# Altium project dualring_rx_v0.1_sensor.PrjPcb
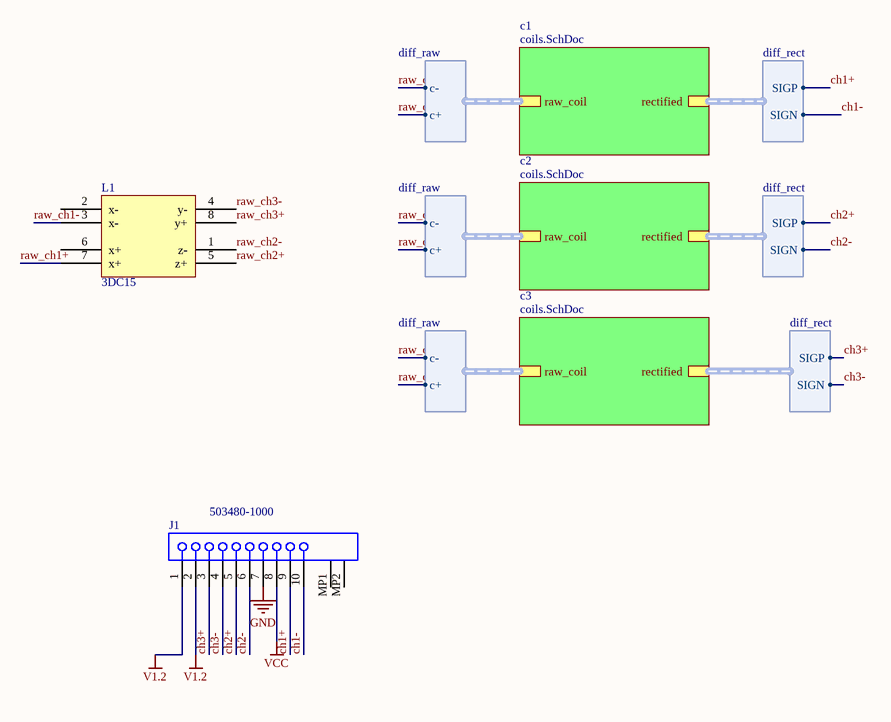
[diagram p0: coil_processing.SchDoc]
2 sheets, 44 parts. Net scope: hierarchical (ports join the sheet entries above them; power ports are global).
Sheets:
  coil_processing.SchDoc
    c1 = coils.SchDoc
    c2 = coils.SchDoc
    c3 = coils.SchDoc

## Sheet coil_processing.SchDoc
size A

### Parts
J1  503480-1000  [MOLX-503480-1000]
L1  3DC15  [3DC15]

### Sub-sheets
c1 = coils.SchDoc: raw_coil (harness diff_raw), rectified (harness diff_rect)
c2 = coils.SchDoc: raw_coil (harness diff_raw), rectified (harness diff_rect)
c3 = coils.SchDoc: raw_coil (harness diff_raw), rectified (harness diff_rect)

### Harnesses
diff_raw: c-, c+
diff_rect: SIGN, SIGP

### Nets
GND: J1.7
V1.2: J1.1 J1.2
VCC: J1.8
ch1+: J1.9 ; sheet c1/rectified.SIGP
ch1-: J1.10 ; sheet c1/rectified.SIGN
ch2+: J1.5 ; sheet c2/rectified.SIGP
ch2-: J1.6 ; sheet c2/rectified.SIGN
ch3+: J1.3 ; sheet c3/rectified.SIGP
ch3-: J1.4 ; sheet c3/rectified.SIGN
raw_ch1+: L1.7(x+) ; sheet c1/raw_coil.c+
raw_ch1-: L1.3(x-) ; sheet c1/raw_coil.c-
raw_ch2+: L1.5(z+) ; sheet c2/raw_coil.c+
raw_ch2-: L1.1(z-) ; sheet c2/raw_coil.c-
raw_ch3+: L1.8(y+) ; sheet c3/raw_coil.c+
raw_ch3-: L1.4(y-) ; sheet c3/raw_coil.c-

Not connected (* = marked no-connect by the designer): J1 MP1 MP2; L1 2(x-) 6(x+)

### Library data of the parts
J1 = CMP-1241-00115-1: 0.5 mm Pitch Easy-On(TM) BackFlip(TM) Type FPC Connector, 1.0 mm Mated Height, Right Angle, SMT, Dual Contact, 10 Circuits, -40 to 85 degC, ELV and RoHS Compliant, Tape and Reel; Manufacturer: Molex; Durability (mating cycles max): 10; Pitch - Mating Interface: 0.50mm; Material - Plating Mating: Gold; Voltage (Max): 50V AC (RMS)/DC; Polarized to PCB: Yes; PCB Locator: No; Current (Max per Contact): 0.5A; Material - Plating Termination: Gold, Tin; Entry Angle: 90degrees Angle; Mated Height: 1.00mm; Material - Metal: Phosphor Bronze; ComponentLink1Description: Manufacturer URL; PartNumber: 503480-1000; Circuits (Loaded): 10; Packing: Tape and Reel; PackageReference: 503480-1000; ComponentLink2URL: http://www.molex.com/webdocs/datasheets/pdf/en-us/5034801000_FFC_FPC_CONNECTORS.pdf; PackageVersion: Rev. F, 09/2012; ComponentLink3Description: Package Specification; ComponentLink3URL: http://www.molex.com/pdm_docs/sd/5034801000_sd.pdf; PackageDescription: 10-Lead FPC Connector, Pitch 0.5 mm; Stackable: No; Mounting Technology: Surface Mount; ComponentLink2Description: Datasheet; PCB Retention: Yes; Number of Rows: 1; Orientation: Right Angle; Contact Position: Dual; RoHS: TRUE; ComponentLink1URL: http://www.molex.com/molex/index.jsp; System: Connector
L1 = 3DV09-A: ComponentLink1Description: Premo; ComponentLink1URL: https://www.grupopremo.com/618-3dcc08-3d-coil-cube-receiver-sensor-for-vr-magnetic-tracking-system-165x148x118-mm-

## Sheet coils.SchDoc: Coils
size A
Used 3 times, as channels c1, c2, c3. Parts and nets are listed once, with the designators drawn on the sheet.
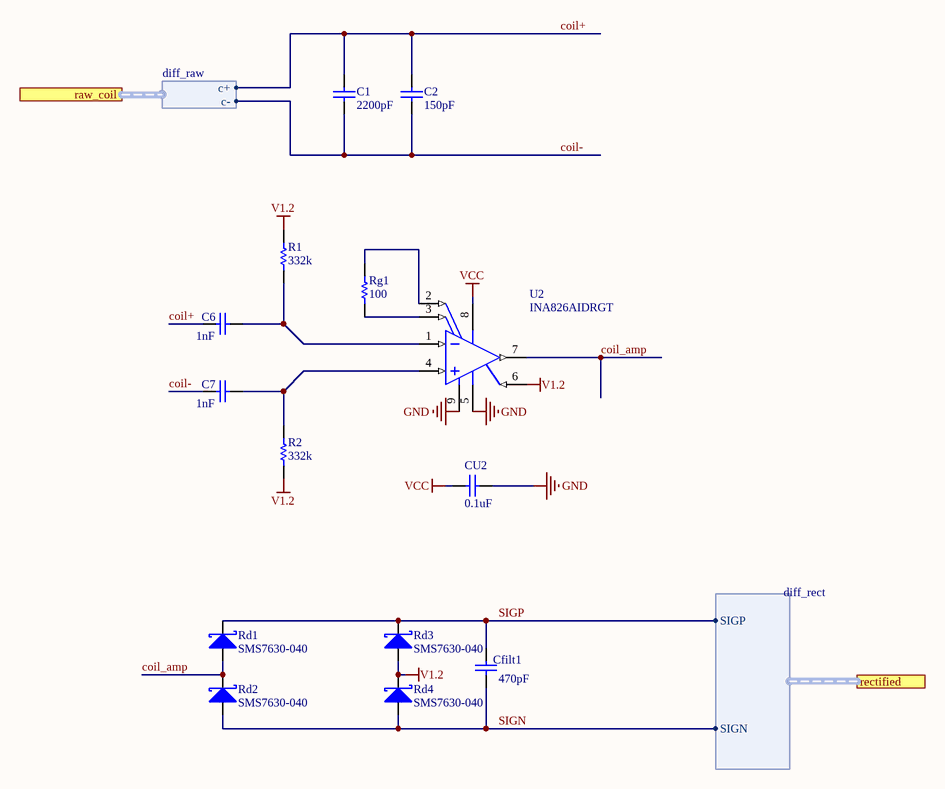
[diagram p1: coils.SchDoc]

### Parts
C1  value 2200pF  [0402]  (hidden comment: Cap)
C2  value 150pF  [0402]  (hidden comment: Cap)
C6  value 1nF  [0402]  (hidden comment: Cap)
C7  value 1nF  [0402]  (hidden comment: Cap)
Cfilt1  value 470pF  [0402]  (hidden comment: Cap)
CU2  value 0.1uF  [0402]  (hidden comment: Cap)
R1  value 332k  [0402]  (hidden comment: Res)
R2  value 332k  [0402]  (hidden comment: Res)
Rd1  SMS7630-040  [0402]
Rd2  SMS7630-040  [0402]
Rd3  SMS7630-040  [0402]
Rd4  SMS7630-040  [0402]
Rg1  value 100  [0402]  (hidden comment: Res)
U2  INA826AIDRGT  [DRG0008A_V]

### Ports
raw_coil (harness diff_raw), rectified (harness diff_rect)

### Harnesses
diff_raw: c-, c+
diff_rect: SIGN, SIGP

### Nets
GND: CU2.1 U2.5(VS-) U2.9(EP)
V1.2: R1.2 R2.1 Rd3.1(A) Rd4.2(K) U2.6(REF)
VCC: CU2.2 U2.8(VS+)
coil+: C1.2 C2.2 C6.1 ; port raw_coil.c+
coil-: C1.1 C2.1 C7.1 ; port raw_coil.c-
coil_amp: Rd1.1(A) Rd2.2(K) U2.7(VOUT)
SIGN: Cfilt1.1 Rd2.1(A) Rd4.1(A) ; port rectified.SIGN
SIGP: Cfilt1.2 Rd1.2(K) Rd3.2(K) ; port rectified.SIGP
NetC6_2: C6.2 R1.1 U2.1(IN-)
NetC7_2: C7.2 R2.2 U2.4(IN+)
NetRg1_1: Rg1.1 U2.2(RG)
NetRg1_2: Rg1.2 U2.3(RG)

### Channels
c1: designators end in _c1
c2: designators end in _c2
c3: designators end in _c3

### Library data of the parts
C1 C2 C6 C7 Cfilt1 CU2 = Cap: Ceramic Capacitor (Surface Mount); Manufacturer: Generic Ceramic Chip Cap (TBD)
  C2 Cfilt1 CU2: Digi-Key Part Number: *; Manufacturer Part Number: *; Note: *; Rating: *
R1 R2 Rg1 = Res: Chip Resistor (Surface Mount); Manufacturer: Generic Chip Res (TBD); Manufacturer Part Number: *; Digi-Key Part Number: *; Rating: *
U2 = CMP-0944-00099-2: Precision, 200-uA Supply Current, 36-V Supply Instrumentation Amplifier, -40 to 125 degC, 8-pin SON (DRG8), Green (RoHS & no Sb/Br); Manufacturer: Texas Instruments; Input Offset Drift (+/-)(Max)(uV/Degrees Celsius): 2; CMRR(Min)(dB): 84; Quiescent Current (+/-)(Typ)(mA): 0.2; Input Offset (+/-)(Max)(uV): 150; Output Offset Drift (+/-)(Max)(uV/Degrees Celsius): 10; Vs(Max)(V): 36; Non-Linearity (+/-)(Max)(%): 0.0005; Input Bias Current (+/-)(Max)(nA): 65; Number of Channels: 1; Noise at 1kHz(Typ)(nV/rt(Hz)): 18; SubFamily: Single Supply; Output Offset (+/-)(Max)(uV): 700; Gain(V/V): 1 to 1000; Vs(Min)(V): 2.7; PartNumber: INA826AIDRGT; PackageVersion: 4205379/C, 12/2010; DatasheetVersion: SBOS562E; Eco-Plan: Green (RoHS & no Sb/Br); Code_JEDEC: MO-229; ComponentLink2Description: Datasheet; ComponentLink3URL: http://www.ti.com/litv/pdf/mpds151b; ComponentLink2URL: http://www.ti.com/general/docs/lit/getliterature.tsp?genericPartNumber=INA826&fileType=pdf; Mounting Technology: Surface Mount; PackageReference: DRG0008A; PackageDescription: 8-Pin Plastic Small Outline, Body 3 x 3 mm, Pitch 0.5 mm; ComponentLink1Description: Manufacturer URL; ComponentLink1URL: http://www.ti.com/; ComponentLink3Description: Package Specification

## Nets that join several sheets
GND: coil_processing (J1.7), c1 (CU2_c1.1 U2_c1.5 U2_c1.9), c2 (CU2_c2.1 U2_c2.5 U2_c2.9), c3 (CU2_c3.1 U2_c3.5 U2_c3.9)
V1.2: coil_processing (J1.1 J1.2), c1 (5 pins), c2 (5 pins), c3 (5 pins)
VCC: coil_processing (J1.8), c1 (CU2_c1.2 U2_c1.8), c2 (CU2_c2.2 U2_c2.8), c3 (CU2_c3.2 U2_c3.8)
ch1+: coil_processing (J1.9), c1 (Cfilt1_c1.2 Rd1_c1.2 Rd3_c1.2)
ch1-: coil_processing (J1.10), c1 (Cfilt1_c1.1 Rd2_c1.1 Rd4_c1.1)
ch2+: coil_processing (J1.5), c2 (Cfilt1_c2.2 Rd1_c2.2 Rd3_c2.2)
ch2-: coil_processing (J1.6), c2 (Cfilt1_c2.1 Rd2_c2.1 Rd4_c2.1)
ch3+: coil_processing (J1.3), c3 (Cfilt1_c3.2 Rd1_c3.2 Rd3_c3.2)
ch3-: coil_processing (J1.4), c3 (Cfilt1_c3.1 Rd2_c3.1 Rd4_c3.1)
raw_ch1+: coil_processing (L1.7), c1 (C1_c1.2 C2_c1.2 C6_c1.1)
raw_ch1-: coil_processing (L1.3), c1 (C1_c1.1 C2_c1.1 C7_c1.1)
raw_ch2+: coil_processing (L1.5), c2 (C1_c2.2 C2_c2.2 C6_c2.1)
raw_ch2-: coil_processing (L1.1), c2 (C1_c2.1 C2_c2.1 C7_c2.1)
raw_ch3+: coil_processing (L1.8), c3 (C1_c3.2 C2_c3.2 C6_c3.1)
raw_ch3-: coil_processing (L1.4), c3 (C1_c3.1 C2_c3.1 C7_c3.1)